# EAGLE design teensy_driver3 (EAGLE 9.6.2)
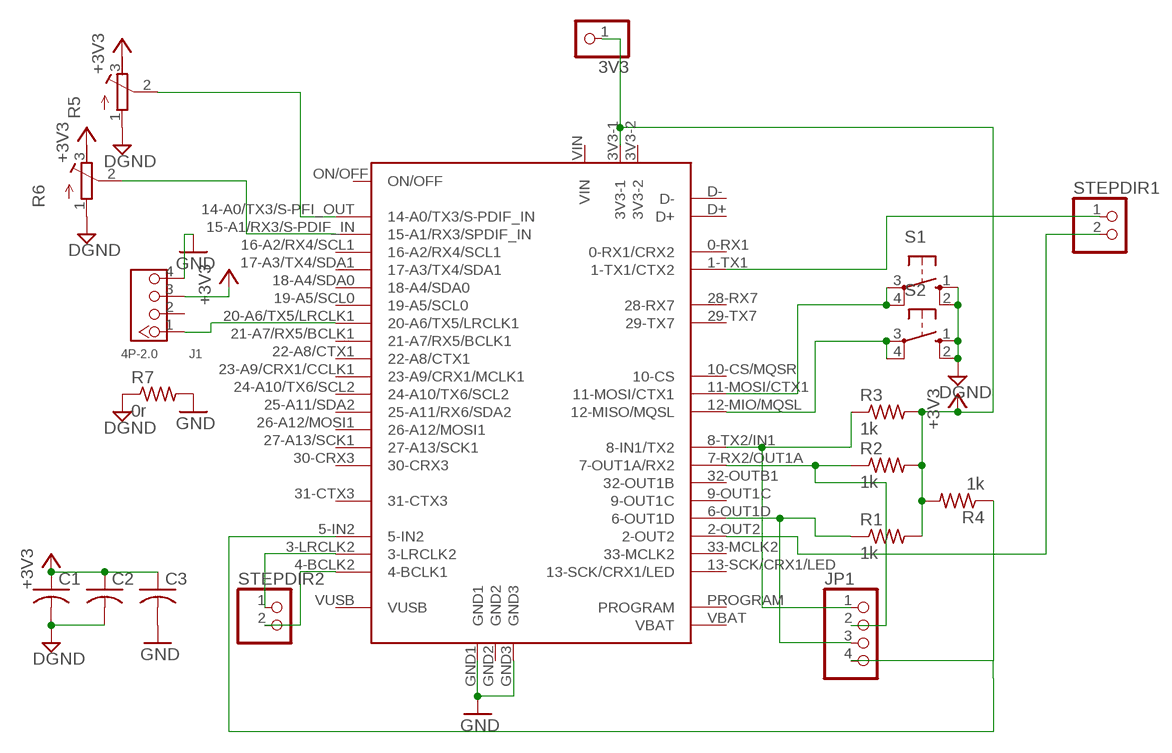
[diagram p0: schematic, sheet 1]

## Parts
3V3  PINHD-1X1  [1X01]
C1  C-US025_050-055X075  [C025_050-055X075]
C2  C-US025_050-055X075  [C025_050-055X075]
C3  C-US025_050-055X075  [C025_050-055X075]
J1  4P-2.0  GROVE-CONNECTOR-DIP(4P-2.0)  [HW4-2.0]
JP1  PINHD-1X4  [1X04]
R1  1k  R-US_0207/7  [0207/7]
R2  1k  R-US_0207/7  [0207/7]
R3  1k  R-US_0207/7  [0207/7]
R4  1k  R-US_0207/7  [0207/7]
R5  R-TRIMM74X  [RTRIM74X]
R6  R-TRIMM74X  [RTRIM74X]
R7  0r  R-US_0204/7  [0204/7]
S1  10-XX  [B3F-10XX]
S2  10-XX  [B3F-10XX]
STEPDIR1  PINHD-1X2  [1X02]
STEPDIR2  PINHD-1X2  [1X02]
U$1  TEENSY40  [TEENSY40]

## Nets
+3V3: 3V3.1 C1.1 C2.1 C3.1 J1.3 R1.2 R2.2 R3.2 R4.2 R5.3(E) R6.3(E) U$1.3V3-1
DGND: C1.2 C2.2 R5.1(A) R6.1(A) R7.1 S1.1(S) S1.2(S1) S2.1(S) S2.2(S1)
GND: C3.2 J1.4 R7.2 U$1.GND1 U$1.GND3
N$1: JP1.3 R1.1 U$1.6-OUT1D
N$2: JP1.2 R2.1 U$1.7-RX2/OUT1A(7-OUT1A/RX2)
N$3: JP1.1 R3.1 U$1.8-TX2/IN1(8-IN1/TX2)
N$4: JP1.4 R4.1 U$1.5-IN2
N$5: STEPDIR1.2 U$1.2-OUT2
N$6: STEPDIR1.1 U$1.1-TX1(1-TX1/CTX2)
N$7: STEPDIR2.1 U$1.3-LRCLK2
N$8: STEPDIR2.2 U$1.4-BCLK2(4-BCLK1)
N$9: J1.1 U$1.20-A6/TX5/LRCLK1
N$10: R5.2(S) U$1.14-A0/TX3/S-PFI_OUT(14-A0/TX3/S-PDIF_IN)
N$11: R6.2(S) U$1.15-A1/RX3/S-PDIF_IN(15-A1/RX3/SPDIF_IN)
N$12: S1.3(P) S1.4(P1) U$1.11-MOSI/CTX1
N$13: S2.3(P) S2.4(P1) U$1.12-MIO/MQSL(12-MISO/MQSL)
Unconnected: J1.2 U$1.0-RX1(0-RX1/CRX2) U$1.3V3-2 U$1.9-OUT1C U$1.10-CS/MQSR(10-CS) U$1.13-SCK/CRX1/LED U$1.16-A2/RX4/SCL1 U$1.17-A3/TX4/SDA1 U$1.18-A4/SDA0 U$1.19-A5/SCL0 U$1.21-A7/RX5/BCLK1 U$1.22-A8/CTX1 U$1.23-A9/CRX1/CCLK1(23-A9/CRX1/MCLK1) U$1.24-A10/TX6/SCL2 U$1.25-A11/SDA2(25-A11/RX6/SDA2) U$1.26-A12/MOSI1 U$1.27-A13/SCK1 U$1.28-RX7 U$1.29-TX7 U$1.30-CRX3 U$1.31-CTX3 U$1.32-OUTB1(32-OUT1B) U$1.33-MCLK2 U$1.D+ U$1.D- U$1.GND2 U$1.ON/OFF U$1.PROGRAM U$1.VBAT U$1.VIN U$1.VUSB

## Library data of the parts
3V3 = pinhead:PINHD-1X1: PIN HEADER
C1-C3 = rcl:C-US: CAPACITOR, American symbol; SPICEPREFIX: C
J1 = OPL_Connector:GROVE-CONNECTOR-DIP(4P-2.0): 320110033
JP1 = pinhead:PINHD-1X4: PIN HEADER
R1-R4 R7 = rcl:R-US_: RESISTOR, American symbol; SPICEPREFIX: R
R5 R6 = rcl:R-TRIMM: Trimm resistor; SPICEMODEL: X; SPICEPREFIXL: POT
S1 S2 = switch-omron:10-XX: OMRON SWITCH; MPN: B3F-1000; OC_FARNELL: 176432; OC_NEWARK: 36M3542
STEPDIR1 STEPDIR2 = pinhead:PINHD-1X2: PIN HEADER
U$1 = teensy:TEENSY40: Teensy 4.0 device including POGO pins for pins 24 - 33, but not yet pins for D+ and D-. Symbol layout is what works for me and may not suite everyone... that can be added or additional symbols can be created to be used in a modilied davie name.

## Board
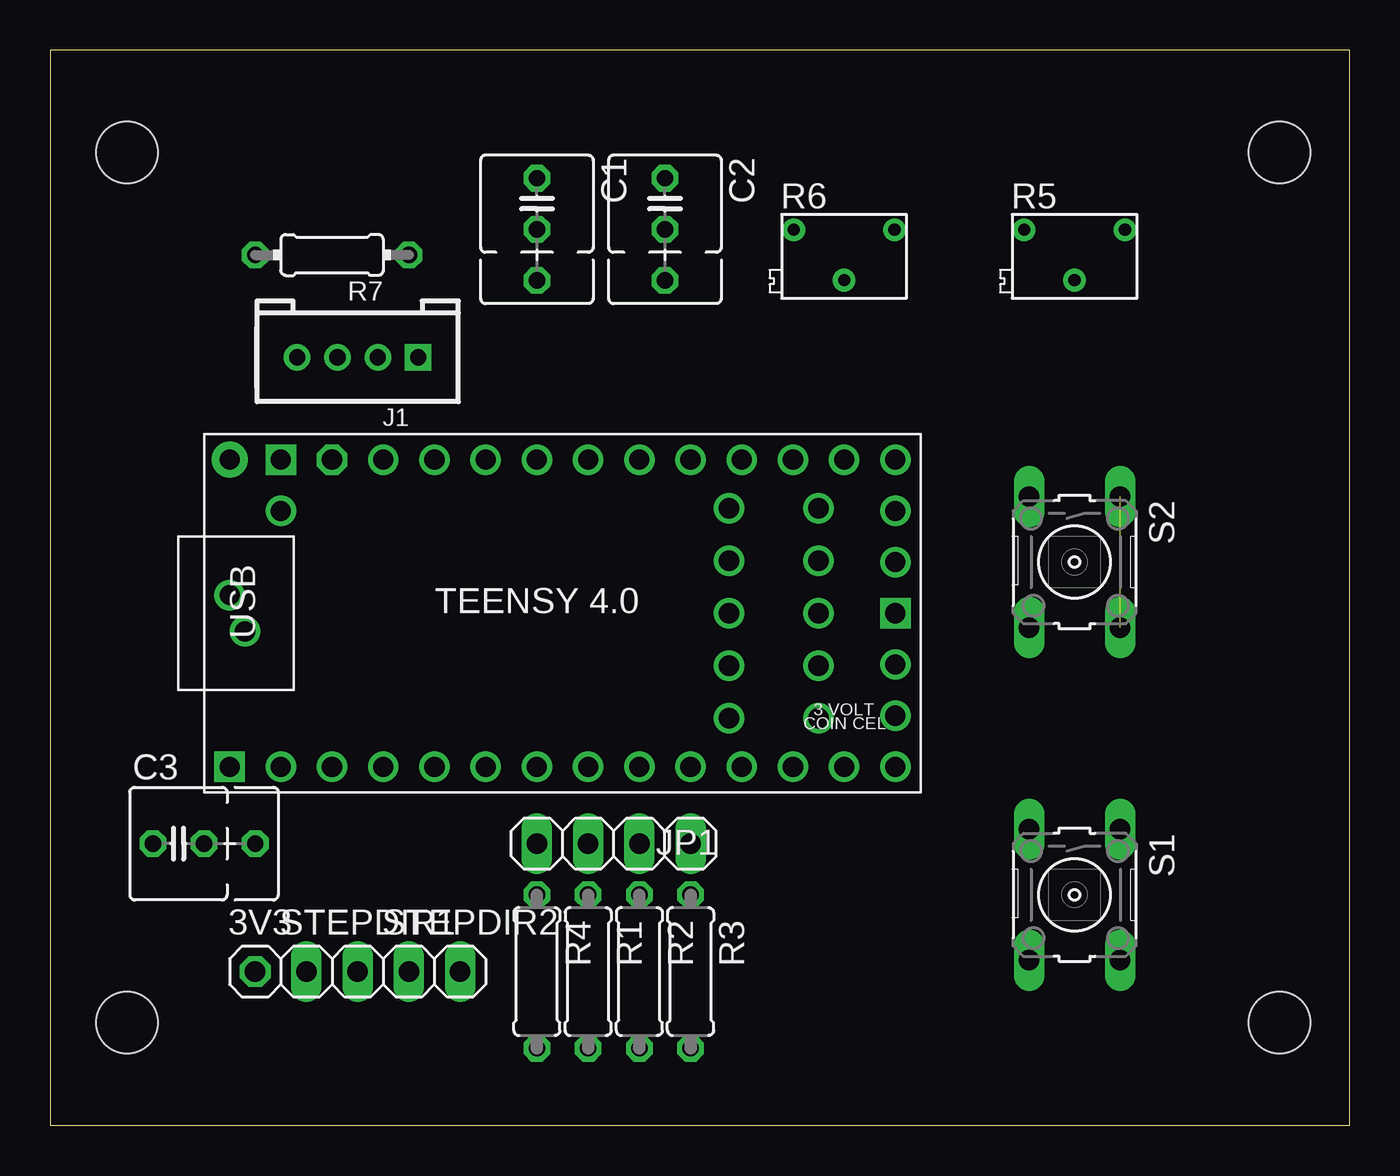
[diagram p1: board, top side]
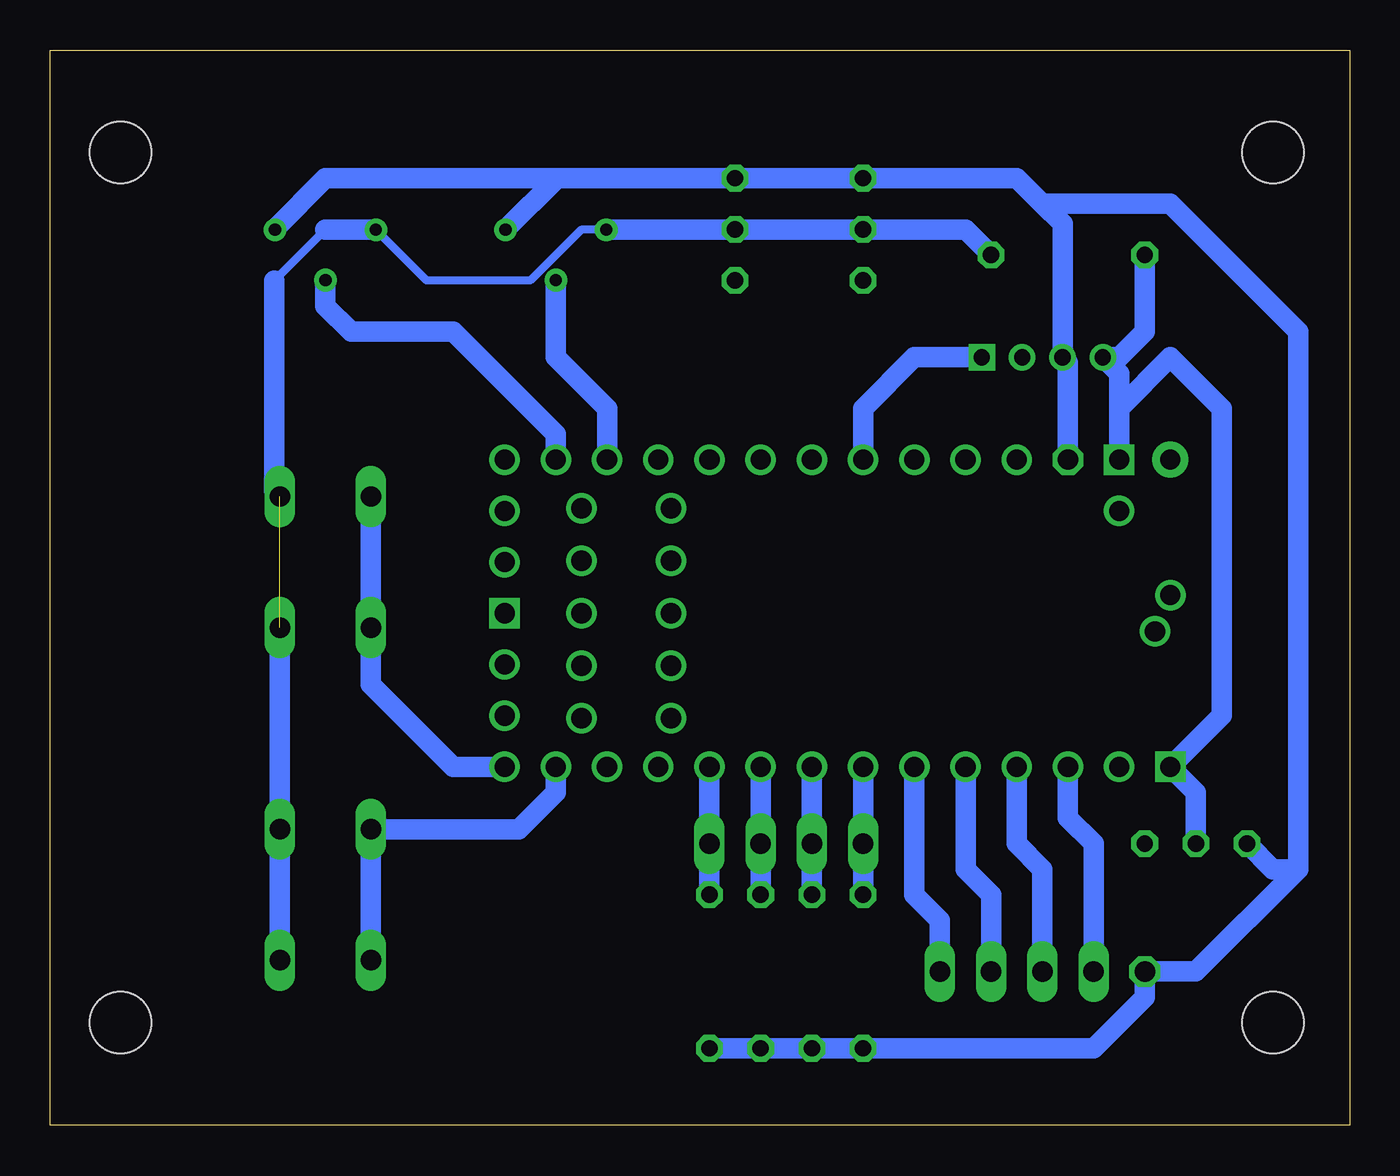
[diagram p2: board, bottom side, seen from below]

Size 64.44 x 53.33 mm. Coordinates in mm from the lower left corner, seen from the top.
Outline: 0,0 64.44,0 64.44,53.33 0,53.33 0,0
Copper layers (1*16): Top 0.035mm / dielectric 1.5mm / Bottom 0.035mm
Design rules "default": minimum track width 6mil, minimum drill 0.35mm, track to track 6mil, track to pad 6mil, pad to pad 6mil, via to via 6mil, smd to smd 6mil, copper to edge 40mil, drill to drill 6mil, minimum pad ring 10mil, minimum via ring 8mil, stop-mask expansion 4mil, vias tented up to drill 0mil, thermal gap 10mil
Holes 3.05 mm at 3.81,48.26 60.96,48.26 60.96,5.08 3.81,5.08

### Footprints (pad centres in the part's own frame; a part is rotated, then mirrored left to right if it is on the bottom)
1X01 = drill 1.016 octagon: 1 0,0
C025_050-055X075 = drill 0.813 octagon: 1 -1.27,0; 2 1.27,0; 3 3.81,0
HW4-2.0 = drill 0.8 pad 1.27 square: 1 -3,0 | drill 0.8 pad 1.27: 2 -1,0; 3 1,0; 4 3,0
1X04 = drill 1.016 long: 1 -3.81,0; 2 -1.27,0; 3 1.27,0; 4 3.81,0
0207/7 = drill 0.813 octagon: 1 -3.81,0; 2 3.81,0
RTRIM74X = drill 0.61: 1 -1.25,-2.5; 2 1.25,0; 3 -1.25,2.5
0204/7 = drill 0.813 octagon: 1 -3.81,0; 2 3.81,0
B3F-10XX = drill 1.016 long: 1 -3.251,2.261; 2 3.251,2.261; 3 -3.251,-2.261; 4 3.251,-2.261
1X02 = drill 1.016 long: 1 -1.27,0; 2 1.27,0
TEENSY40 = drill 1: 0-RX1 -13.97,-7.62; 1-TX1 -11.43,-7.62; 2-OUT2 -8.89,-7.62; 3-LRCLK2 -6.35,-7.62; 3V3-2 16.51,-2.54; 4-BCLK2 -3.81,-7.62; 5-IN2 -1.27,-7.62; 6-OUT1D 1.27,-7.62; 7-RX2/OUT1A 3.81,-7.62; 8-TX2/IN1 6.35,-7.62; 9-OUT1C 8.89,-7.62; 10-CS/MQSR 11.43,-7.62; 11-MOSI/CTX1 13.97,-7.62; 12-MIO/MQSL 16.51,-7.62; 13-SCK/CRX1/LED 16.51,7.62; 14-A0/TX3/S-PFI_OUT 13.97,7.62; 15-A1/RX3/S-PDIF_IN 11.43,7.62; 16-A2/RX4/SCL1 8.89,7.62; 17-A3/TX4/SDA1 6.35,7.62; 18-A4/SDA0 3.81,7.62; 19-A5/SCL0 1.27,7.62; 20-A6/TX5/LRCLK1 -1.27,7.62; 21-A7/RX5/BCLK1 -3.81,7.62; 22-A8/CTX1 -6.35,7.62; 23-A9/CRX1/CCLK1 -8.89,7.62; 24-A10/TX6/SCL2 12.7,5.207; 25-A11/SDA2 8.255,5.207; 26-A12/MOSI1 12.7,2.603; 27-A13/SCK1 8.255,2.603; 28-RX7 12.7,0; 29-TX7 8.255,0; 30-CRX3 12.7,-2.603; 31-CTX3 8.255,-2.603; 32-OUTB1 12.7,-5.207; 33-MCLK2 8.255,-5.207; D+ -15.75,-0.9; D- -16.51,0.9; ON/OFF 16.51,5.08; PROGRAM 16.51,2.54; VBAT 16.51,-5.08; VUSB -13.97,5.08 | drill 1 octagon: 3V3-1 -11.43,7.62 | drill 1 square: GND1 -16.51,-7.62; GND2 16.51,0; GND3 -13.97,7.62 | drill 1 pad 1.778: VIN -16.51,7.62

### Placement (x,y rotation side)
3V3  10.16,7.62 0 top
C1  24.13,45.72 270 top
C2  30.48,45.72 270 top
C3  6.35,13.97 0 top
J1  15.24,38.1 180 top
JP1  27.94,13.97 180 top
R1  26.67,7.62 270 top
R2  29.21,7.62 270 top
R3  31.75,7.62 270 top
R4  24.13,7.62 270 top
R5  50.8,43.18 270 top
R6  39.37,43.18 270 top
R7  13.97,43.18 180 top
S1  50.8,11.43 270 top
S2  50.8,27.94 270 top
STEPDIR1  13.97,7.62 0 top
STEPDIR2  19.05,7.62 0 top
U$1  25.4,25.4 0 top

### Tracks (layer width: path | path; a pad name or v marks a point on that pad's centre or on a via)
+3V3
  Bottom 1.016: U$1.3V3-1 13.97,37.83 J1.3 14.24,44.72 15.24,45.72 | R3.2 R2.2 R1.2 R4.2 12.7,3.81 10.16,6.35 3V3.1 7.62,7.62 2.54,12.7 | R6.3 39.31,46.99 | 15.24,45.72 16.51,46.99 C1.1 C2.1 39.31,46.99 | 39.31,46.99 50.8,46.99 53.3,44.49 R5.3 | 15.24,45.72 8.89,45.72 2.54,39.37 2.54,12.7 | C3.1 3.81,12.7 2.54,12.7
DGND  (1 unrouted)
  Bottom 0.406: 50.82,44.43 53.34,41.91 | R6.1 38.12,44.43 40.64,41.91 45.78,41.91 R5.1
  Bottom 1.016: R7.1 19.03,44.43 24.15,44.43 | 30.46,44.43 R6.1 | R5.1 50.82,44.43 | 53.34,41.91 53.34,31.47 S2.1 | S2.2 S1.1 S1.2 | C1.2 24.15,44.43 | 24.15,44.43 27.94,44.43 30.46,44.43 | C2.2 30.46,44.43
GND
  Bottom 0.61: 11.43,35.56 U$1.GND3
  Bottom 1.016: U$1.GND3 11.43,37.29 J1.4 11.43,38.1 10.16,39.37 R7.2 | 11.43,35.56 8.89,38.1 6.35,35.56 6.35,20.32 U$1.GND1 7.62,16.51 C3.2
N$1
  Bottom 1.016: U$1.6-OUT1D JP1.3 R1.1
N$2
  Bottom 1.016: U$1.7-RX2/OUT1A JP1.2 R2.1
N$3
  Bottom 1.016: U$1.8-TX2/IN1 JP1.1 R3.1
N$4
  Bottom 1.016: U$1.5-IN2 JP1.4 R4.1
N$5
  Bottom 1.016: U$1.2-OUT2 16.51,13.97 15.24,12.7 STEPDIR1.2
N$6
  Bottom 1.016: STEPDIR1.1 12.7,13.97 13.97,15.24 U$1.1-TX1
N$7
  Bottom 1.016: U$1.3-LRCLK2 19.05,12.7 17.78,11.43 STEPDIR2.1
N$8
  Bottom 1.016: STEPDIR2.2 20.32,10.16 21.59,11.43 U$1.4-BCLK2
N$9
  Bottom 1.016: J1.1 21.59,38.1 24.13,35.56 U$1.20-A6/TX5/LRCLK1
N$10
  Bottom 1.016: U$1.14-A0/TX3/S-PFI_OUT 39.37,34.29 44.45,39.37 49.53,39.37 50.8,40.64 R5.2
N$11
  Bottom 1.016: R6.2 39.37,38.1 36.83,35.56 U$1.15-A1/RX3/S-PDIF_IN
N$12
  Bottom 1.016: U$1.11-MOSI/CTX1 39.37,16.51 41.2,14.68 S1.3 S1.4
N$13
  Bottom 1.016: U$1.12-MIO/MQSL 44.45,17.78 48.54,21.87 S2.4 S2.3